# EAGLE board FranKinksTides (EAGLE 7.2.0), part 1 of 2
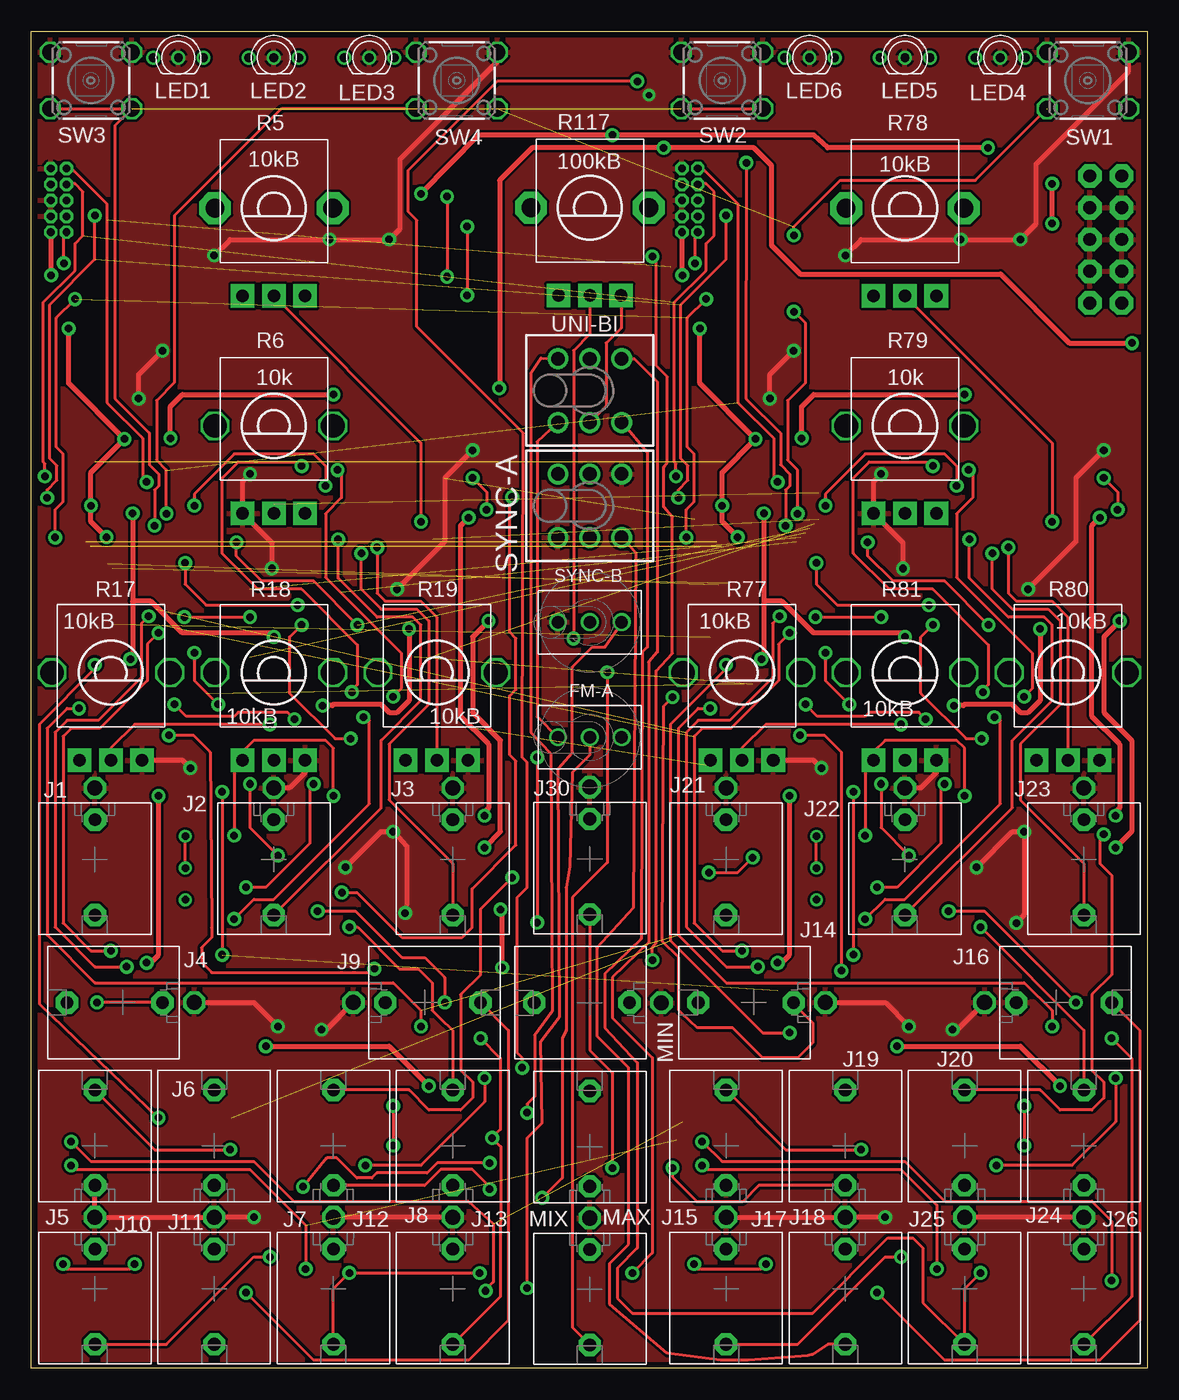
[diagram p7: board, top side]
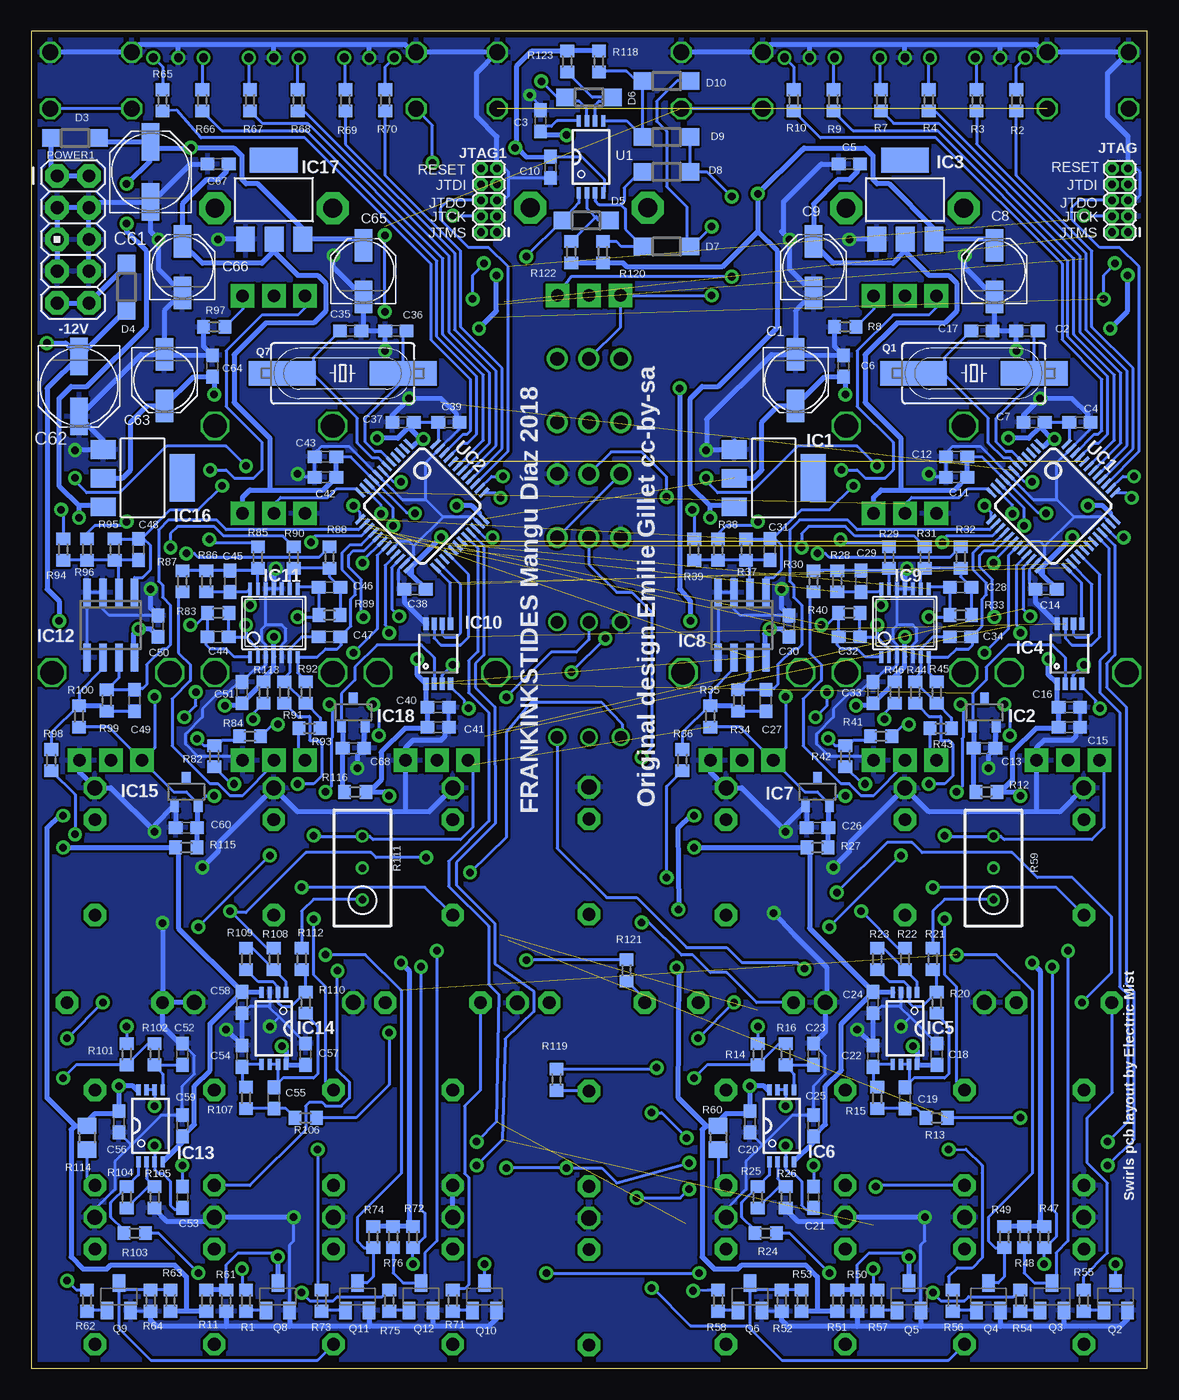
[diagram p8: board, bottom side, seen from below]

Size 89.14 x 106.8 mm. Coordinates in mm from the lower left corner, seen from the top.
Outline: 89.14,0 0,0 0,106.8 89.14,106.8 89.14,0
Copper layers (1*16): Top 0.035mm / dielectric 1.5mm / Bottom 0.035mm
Design rules "PCBCart-Standard *": minimum track width 10mil, minimum drill 0.4mm, track to track 8mil, track to pad 8mil, pad to pad 8mil, via to via 8mil, smd to smd 8mil, copper to edge 20mil, drill to drill 8mil, minimum pad ring 8mil, minimum via ring 10mil, stop-mask expansion 3mil, vias tented up to drill 25mil, thermal gap 8mil

## Footprints (pad centres in the part's own frame; a part is rotated, then mirrored left to right if it is on the bottom)
PANASONIC_C = smd 2.6 x 1.4: + 2.05,0; - -2.05,0
C0603 = smd 1.1 x 1: 1 -0.85,0; 2 0.85,0
PANASONIC_D = smd 3 x 1.4: + 2.4,0; - -2.4,0
SOD123 = smd 1.4 x 1.4: A 1.9,0; C -1.9,0
SUBMINI_TOGGLE = drill 1 pad 1.422: 1 -2.54,0; 3 2.54,0; COM 0,0
SOT223 = smd 1.499 x 2.007: 1 -2.261,-3.15; 2 0.025,-3.15; 3 2.311,-3.15 | smd 3.81 x 2.007: 4 0,3.15
DBZ_R-PDSO-G3 = smd 0.7 x 1: 1 -0.95,-1.1; 2 0.95,-1.1; 3 0,1.1
MSOP-8 = smd 0.41 x 1.02: 1 -0.975,-2.4; 2 -0.325,-2.4; 3 0.325,-2.4; 4 0.975,-2.4; 5 0.975,2.4; 6 0.325,2.4; 7 -0.325,2.4; 8 -0.975,2.4
TSSOP-8 = smd 0.9 x 0.35: 1 -2.875,0.975; 2 -2.875,0.325; 3 -2.875,-0.325; 4 -2.875,-0.975; 5 2.875,-0.975; 6 2.875,-0.325; 7 2.875,0.325; 8 2.875,0.975
SO08 = smd 0.6 x 2.2: 1 -1.905,-2.6; 2 -0.635,-2.6; 3 0.635,-2.6; 4 1.905,-2.6; 5 1.905,2.6; 6 0.635,2.6; 7 -0.635,2.6; 8 -1.905,2.6
TSSOP14 = smd 0.305 x 0.991: 1 -1.905,-2.718; 2 -1.27,-2.718; 3 -0.635,-2.718; 4 0,-2.718; 5 0.635,-2.718; 6 1.27,-2.718; 7 1.905,-2.718; 8 1.905,2.718; 9 1.27,2.718; 10 0.635,2.718; 11 0,2.718; 12 -0.635,2.718; 13 -1.27,2.718; 14 -1.905,2.718
OG-PJ301_VARIATIONS_WQP_PJ_301M6 = drill 1.2 pad 1.778 octagon: P1 0,-5.715 | drill 1.016 pad 1.778 octagon: P2 0,-3.175; P3 0,4.445
2X5-1.27 = drill 0.61 pad 1.067 octagon: 1 -1.27,3.81; 2 0,3.81; 3 -1.27,2.54; 4 0,2.54; 5 -1.27,1.27; 6 0,1.27; 7 -1.27,0; 8 0,0; 9 -1.27,-1.27; 10 0,-1.27
LED-BICOLOR-THROUGHHOLE = drill 0.7: 1 -2,0; 2 0,0; 3 2,0
AVR_ICSP = drill 1.016 pad 1.88 octagon: 1 -1.27,5.08; 2 1.27,5.08; 3 -1.27,2.54; 4 1.27,2.54; 5 -1.27,0; 6 1.27,0; 7 -1.27,-2.54; 8 1.27,-2.54; 9 -1.27,-5.08; 10 1.27,-5.08
HC49UP = smd 5.334 x 1.93: 1 -4.826,0; 2 4.826,0
SOT23-BEC = smd 1 x 1.4: B -0.95,-1.1; C 0,1.1; E 0.95,-1.1
R0603 = smd 1 x 1.1: 1 -0.85,0; 2 0.85,0
ALPS_POT_VERTICAL_PS = drill 1 pad 1.88 square: P$1 -2.5,7; P$2 0,7; P$3 2.5,7 | drill 1.5 pad 2.54 octagon: P$4 -4.7,0; P$5 4.7,0
TALLTRIMMER = drill 1 pad 1.88 square: P$1 -2.5,7; P$2 0,7; P$3 2.5,7 | drill 1.9 pad 2.1 octagon: P$4 -4.7,0; P$5 4.7,0
RTRIM3296W = drill 0.61: 1 0,-2.54; 2 0,0; 3 0,2.54
R0805 = smd 1.3 x 1.5: 1 -0.95,0; 2 0.95,0
TL1100X = drill 1.27 octagon: 1 -3.251,-2.261; 2 3.251,-2.261; 3 -3.251,2.261; 4 3.251,2.261
TL4XPO = drill 1.1 pad 1.676: 1 -2.54,2.54; 2 0,2.54; 3 2.54,2.54; 4 -2.54,-2.54; 5 0,-2.54; 6 2.54,-2.54
LQFP48 = smd 0.254 x 1: 1 -2.75,-4.25; 2 -2.25,-4.25; 3 -1.75,-4.25; 4 -1.25,-4.25; 5 -0.75,-4.25; 6 -0.25,-4.25; 7 0.25,-4.25; 8 0.75,-4.25; 9 1.25,-4.25; 10 1.75,-4.25; 11 2.25,-4.25; 12 2.75,-4.25; 25 2.75,4.25; 26 2.25,4.25; 27 1.75,4.25; 28 1.25,4.25; 29 0.75,4.25; 30 0.25,4.25; 31 -0.25,4.25; 32 -0.75,4.25; 33 -1.25,4.25; 34 -1.75,4.25; 35 -2.25,4.25; 36 -2.75,4.25 | smd 1 x 0.254: 13 4.25,-2.75; 14 4.25,-2.25; 15 4.25,-1.75; 16 4.25,-1.25; 17 4.25,-0.75; 18 4.25,-0.25; 19 4.25,0.25; 20 4.25,0.75; 21 4.25,1.25; 22 4.25,1.75; 23 4.25,2.25; 24 4.25,2.75; 37 -4.25,2.75; 38 -4.25,2.25; 39 -4.25,1.75; 40 -4.25,1.25; 41 -4.25,0.75; 42 -4.25,0.25; 43 -4.25,-0.25; 44 -4.25,-0.75; 45 -4.25,-1.25; 46 -4.25,-1.75; 47 -4.25,-2.25; 48 -4.25,-2.75

## Placement (x,y rotation side)
C1  22u  [PANASONIC_C]  28.1,78.93 270 bottom
C2  18p  [C0603]  9.62,82.85 0 bottom
C3  100n  [C0603]  48.47,99.64 90 bottom
C4  100n  [C0603]  5.4,75.56 0 bottom
C5  100n  [C0603]  23.81,96.2 180 bottom
C6  100n  [C0603]  24.28,80.06 90 bottom
C7  100n  [C0603]  9.05,75.56 180 bottom
C8  22u  [PANASONIC_C]  12.22,87.63 90 bottom
C9  22u  [PANASONIC_C]  26.67,87.95 90 bottom
C10  100n  [C0603]  47.67,95.93 90 bottom
C11  3.3u  [C0603]  15.24,71.18 180 bottom
C12  100n  [C0603]  15.24,72.82 180 bottom
C13  470n  [C0603]  13.02,49.53 0 bottom
C14  100n  [C0603]  8.1,62.23 180 bottom
C15  3.3u  [C0603]  6.24,51.2 0 bottom
C16  100n  [C0603]  6.24,52.78 0 bottom
C17  18p  [C0603]  13.23,82.87 180 bottom
C18  100n  [C0603]  16.83,25.08 90 bottom
C19  220p  [C0603]  19.37,21.59 90 bottom
C20  100n  [C0603]  31.75,19.68 270 bottom
C21  220p  [C0603]  26.67,13.65 270 bottom
C22  220p  [C0603]  21.91,24.93 90 bottom
C23  220p  [C0603]  26.67,25.08 90 bottom
C24  100n  [C0603]  21.91,29.21 90 bottom
C25  100n  [C0603]  26.67,19.37 270 bottom
C26  470n  [C0603]  26.35,43.18 180 bottom
C27  1n  [C0603]  30.48,53.34 90 bottom
C28  10n  [C0603]  14.92,62.39 180 bottom
C29  10n  [C0603]  22.86,62.87 270 bottom
C30  100n  [C0603]  28.62,59.28 90 bottom
C31  1n  [C0603]  30.16,65.41 90 bottom
C32  10n  [C0603]  23.81,58.42 180 bottom
C33  100n  [C0603]  21.91,53.98 90 bottom
C34  1n  [C0603]  14.92,58.42 0 bottom
C35  18p  [C0603]  63.63,82.87 180 bottom
C36  18p  [C0603]  60.02,82.85 0 bottom
C37  100n  [C0603]  59.45,75.56 180 bottom
C38  100n  [C0603]  58.5,62.23 180 bottom
C39  100n  [C0603]  55.8,75.56 0 bottom
C40  100n  [C0603]  56.64,52.78 0 bottom
C41  3.3u  [C0603]  56.64,51.2 0 bottom
C42  3.3u  [C0603]  65.64,71.18 180 bottom
C43  100n  [C0603]  65.64,72.82 180 bottom
C44  10n  [C0603]  74.21,58.42 180 bottom
C45  10n  [C0603]  73.26,62.87 270 bottom
C46  10n  [C0603]  65.32,62.39 180 bottom
C47  1n  [C0603]  65.32,58.42 0 bottom
C48  1n  [C0603]  80.56,65.41 90 bottom
C49  1n  [C0603]  80.88,53.34 90 bottom
C50  100n  [C0603]  79.02,59.28 90 bottom
C51  100n  [C0603]  72.31,53.98 90 bottom
C52  220p  [C0603]  77.07,25.08 90 bottom
C53  220p  [C0603]  77.07,13.65 270 bottom
C54  220p  [C0603]  72.31,24.93 90 bottom
C55  220p  [C0603]  69.77,21.59 90 bottom
C56  100n  [C0603]  82.15,19.68 270 bottom
C57  100n  [C0603]  67.23,25.08 90 bottom
C58  100n  [C0603]  72.31,29.21 90 bottom
C59  100n  [C0603]  77.07,19.37 270 bottom
C60  470n  [C0603]  76.75,43.18 180 bottom
C61  47u  [PANASONIC_D]  79.61,95.57 90 bottom
C62  47u  [PANASONIC_D]  85.33,78.42 270 bottom
C63  22u  [PANASONIC_C]  78.5,78.93 270 bottom
C64  100n  [C0603]  74.68,80.06 90 bottom
C65  22u  [PANASONIC_C]  62.62,87.63 90 bottom
C66  22u  [PANASONIC_C]  77.07,87.95 90 bottom
C67  100n  [C0603]  74.21,96.2 180 bottom
C68  470n  [C0603]  63.42,49.53 0 bottom
D3  1N5819HW  [SOD123]  85.64,98.27 180 bottom
D4  1N5819HW  [SOD123]  81.52,86.36 270 bottom
D5  1N4148  [SOD123]  44.83,91.69 0 bottom
D6  1N4148  [SOD123]  44.6,101.53 180 bottom
D7  1N4148  [SOD123]  38.41,89.61 180 bottom
D8  1N4148  [SOD123]  38.41,95.58 180 bottom
D9  1N4148  [SOD123]  38.41,98.36 0 bottom
D10  1N4148  [SOD123]  38.41,102.83 0 bottom
FM-A  SUBMINI_SPDT  [SUBMINI_TOGGLE]  44.6,50.4 0 top
IC1  LM1117-3.3  [SOT223]  29.84,71.12 270 bottom
IC2  LM4040B25  [DBZ_R-PDSO-G3]  13.02,52.39 0 bottom
IC3  LM1117-3.3  [SOT223]  19.37,93.34 0 bottom
IC4  DAC8552  [MSOP-8]  6.24,57.07 0 bottom
IC5  TL072  [TSSOP-8]  19.37,27.14 270 bottom
IC6  TL072  [TSSOP-8]  29.21,19.37 90 bottom
IC7  LM4040B10  [DBZ_R-PDSO-G3]  26.35,46.04 0 bottom
IC8  MCP6002  [SO08]  32.38,59.37 180 bottom
IC9  MCP6004  [TSSOP14]  19.37,59.53 0 bottom
IC10  DAC8552  [MSOP-8]  56.64,57.07 0 bottom
IC11  MCP6004  [TSSOP14]  69.77,59.53 0 bottom
IC12  MCP6002  [SO08]  82.78,59.37 180 bottom
IC13  TL072  [TSSOP-8]  79.61,19.37 90 bottom
IC14  TL072  [TSSOP-8]  69.77,27.14 270 bottom
IC15  LM4040B10  [DBZ_R-PDSO-G3]  76.75,46.04 0 bottom
IC16  LM1117-3.3  [SOT223]  80.25,71.12 270 bottom
IC17  LM1117-3.3  [SOT223]  69.77,93.34 0 bottom
IC18  LM4040B25  [DBZ_R-PDSO-G3]  63.42,52.39 0 bottom
J1  PJ301_GUI6  [OG-PJ301_VARIATIONS_WQP_PJ_301M6]  5.08,40.64 180 top
J2  PJ301_GUI6  [OG-PJ301_VARIATIONS_WQP_PJ_301M6]  19.37,40.64 180 top
J3  PJ301_GUI6  [OG-PJ301_VARIATIONS_WQP_PJ_301M6]  33.66,40.64 180 top
J4  PJ301_GUI6  [OG-PJ301_VARIATIONS_WQP_PJ_301M6]  7.3,29.21 90 top
J5  PJ301_GUI6  [OG-PJ301_VARIATIONS_WQP_PJ_301M6]  5.08,17.78 0 top
J6  PJ301_GUI6  [OG-PJ301_VARIATIONS_WQP_PJ_301M6]  14.61,17.78 0 top
J7  PJ301_GUI6  [OG-PJ301_VARIATIONS_WQP_PJ_301M6]  24.13,17.78 0 top
J8  PJ301_GUI6  [OG-PJ301_VARIATIONS_WQP_PJ_301M6]  33.66,17.78 0 top
J9  PJ301_GUI6  [OG-PJ301_VARIATIONS_WQP_PJ_301M6]  31.44,29.21 270 top
J10  PJ301_GUI6  [OG-PJ301_VARIATIONS_WQP_PJ_301M6]  5.08,6.35 180 top
J11  PJ301_GUI6  [OG-PJ301_VARIATIONS_WQP_PJ_301M6]  14.61,6.35 180 top
J12  PJ301_GUI6  [OG-PJ301_VARIATIONS_WQP_PJ_301M6]  24.13,6.35 180 top
J13  PJ301_GUI6  [OG-PJ301_VARIATIONS_WQP_PJ_301M6]  33.66,6.35 180 top
J14  PJ301_GUI6  [OG-PJ301_VARIATIONS_WQP_PJ_301M6]  57.7,29.21 90 top
J15  PJ301_GUI6  [OG-PJ301_VARIATIONS_WQP_PJ_301M6]  55.48,17.78 0 top
J16  PJ301_GUI6  [OG-PJ301_VARIATIONS_WQP_PJ_301M6]  81.84,29.21 270 top
J17  PJ301_GUI6  [OG-PJ301_VARIATIONS_WQP_PJ_301M6]  55.48,6.35 180 top
J18  PJ301_GUI6  [OG-PJ301_VARIATIONS_WQP_PJ_301M6]  65,6.35 180 top
J19  PJ301_GUI6  [OG-PJ301_VARIATIONS_WQP_PJ_301M6]  65,17.78 0 top
J20  PJ301_GUI6  [OG-PJ301_VARIATIONS_WQP_PJ_301M6]  74.53,17.78 0 top
J21  PJ301_GUI6  [OG-PJ301_VARIATIONS_WQP_PJ_301M6]  55.48,40.64 180 top
J22  PJ301_GUI6  [OG-PJ301_VARIATIONS_WQP_PJ_301M6]  69.77,40.64 180 top
J23  PJ301_GUI6  [OG-PJ301_VARIATIONS_WQP_PJ_301M6]  84.06,40.64 180 top
J24  PJ301_GUI6  [OG-PJ301_VARIATIONS_WQP_PJ_301M6]  84.06,17.78 0 top
J25  PJ301_GUI6  [OG-PJ301_VARIATIONS_WQP_PJ_301M6]  74.53,6.35 180 top
J26  PJ301_GUI6  [OG-PJ301_VARIATIONS_WQP_PJ_301M6]  84.06,6.35 180 top
J30  PJ301_GUI6  [OG-PJ301_VARIATIONS_WQP_PJ_301M6]  44.6,40.7 180 top
JTAG  M05X2MINIJTAG  [2X5-1.27]  2.82,94.56 180 bottom
JTAG1  M05X2MINIJTAG  [2X5-1.27]  53.22,94.56 180 bottom
LED1  WP115VEGW  [LED-BICOLOR-THROUGHHOLE]  11.75,104.68 0 top
LED2  WP115VEGW  [LED-BICOLOR-THROUGHHOLE]  19.37,104.68 0 top
LED3  WP115VEGW  [LED-BICOLOR-THROUGHHOLE]  26.99,104.68 0 top
LED4  WP115VEGW  [LED-BICOLOR-THROUGHHOLE]  77.39,104.68 0 top
LED5  WP115VEGW  [LED-BICOLOR-THROUGHHOLE]  69.77,104.68 0 top
LED6  WP115VEGW  [LED-BICOLOR-THROUGHHOLE]  62.15,104.68 0 top
MAX  PJ301_GUI6  [OG-PJ301_VARIATIONS_WQP_PJ_301M6]  44.6,17.7 0 top
MIN  PJ301_GUI6  [OG-PJ301_VARIATIONS_WQP_PJ_301M6]  44.6,29.2 90 top
MIX  PJ301_GUI6  [OG-PJ301_VARIATIONS_WQP_PJ_301M6]  44.6,6.3 180 top
POWER1  M05X2PTH  [AVR_ICSP]  85.8,90.17 0 bottom
Q1  8MHz  [HC49UP]  13.87,79.48 0 bottom
Q2  MMBT3904  [SOT23-BEC]  2.54,5.71 0 bottom
Q3  MMBT3904  [SOT23-BEC]  7.62,5.71 0 bottom
Q4  MMBT3904  [SOT23-BEC]  12.7,5.71 0 bottom
Q5  MMBT3904  [SOT23-BEC]  19.05,5.71 0 bottom
Q6  MMBT3904  [SOT23-BEC]  31.75,5.71 0 bottom
Q7  8MHz  [HC49UP]  64.27,79.48 0 bottom
Q8  MMBT3904  [SOT23-BEC]  69.45,5.71 0 bottom
Q9  MMBT3904  [SOT23-BEC]  82.15,5.71 0 bottom
Q10  MMBT3904  [SOT23-BEC]  52.94,5.71 0 bottom
Q11  MMBT3904  [SOT23-BEC]  63.1,5.71 0 bottom
Q12  MMBT3904  [SOT23-BEC]  58.02,5.71 0 bottom
R1  10k  [R0603]  71.99,5.4 270 bottom
R2  100  [R0603]  10.48,101.28 90 bottom
R3  100  [R0603]  13.65,101.28 90 bottom
R4  100  [R0603]  17.46,101.28 90 bottom
R5  10kB  [ALPS_POT_VERTICAL_PS]  19.37,92.66 180 top
R6  10k  [TALLTRIMMER]  19.37,75.28 180 top
R7  100  [R0603]  21.27,101.28 90 bottom
R8  2.49k  [R0603]  24.13,83.19 0 bottom
R9  100  [R0603]  25.08,101.28 90 bottom
R10  100  [R0603]  28.26,101.28 90 bottom
R11  4.7k  [R0603]  75.17,5.4 270 bottom
R12  3.3k  [R0603]  12.86,46.04 180 bottom
R13  33k  [R0603]  16.83,20 0 bottom
R14  100k  [R0603]  31.11,25.08 90 bottom
R15  33k  [R0603]  21.59,21.59 270 bottom
R16  100k  [R0603]  28.89,25.08 90 bottom
R17  10kB  [TALLTRIMMER]  6.35,55.56 180 top
R18  10kB  [TALLTRIMMER]  19.37,55.56 180 top
R19  10kB  [TALLTRIMMER]  32.38,55.56 180 top
R20  30k  [R0603]  16.83,29.21 270 bottom
R21  220k  [R0603]  17.14,32.7 90 bottom
R22  100  [R0603]  19.37,32.7 270 bottom
R23  120k  [R0603]  21.59,32.7 270 bottom
R24  100  [R0603]  30.48,10.79 180 bottom
R25  220k  [R0603]  31.11,13.65 270 bottom
R26  100k  [R0603]  28.89,13.65 90 bottom
R27  270  [R0603]  26.35,41.59 0 bottom
R28  33k  [R0603]  24.77,62.87 90 bottom
R29  100k  [R0603]  20.64,64.77 90 bottom
R30  100k  [R0603]  26.67,62.87 270 bottom
R31  100k  [R0603]  17.78,64.77 90 bottom
R32  100k  [R0603]  14.92,64.77 90 bottom
R33  33k  [R0603]  14.92,60.16 0 bottom
R34  20k  [R0603]  32.7,53.34 270 bottom
R35  120k  [R0603]  34.92,52.07 270 bottom
R36  100k  [R0603]  37.15,48.58 270 bottom
R37  27k  [R0603]  32.07,65.41 270 bottom
R38  100k  [R0603]  34.29,65.41 90 bottom
R39  100k  [R0603]  36.2,65.41 90 bottom
R40  33k  [R0603]  23.81,60.33 0 bottom
R41  100k  [R0603]  21.27,50.48 0 bottom
R42  100k  [R0603]  24.13,48.9 270 bottom
R43  120k  [R0603]  16.51,51.12 180 bottom
R44  100k  [R0603]  18.54,53.98 270 bottom
R45  39k  [R0603]  16.83,53.98 270 bottom
R46  3.3M  [R0603]  20.19,53.98 90 bottom
R47  10k  [R0603]  8.26,10.48 90 bottom
R48  10k  [R0603]  9.84,10.48 90 bottom
R49  10k  [R0603]  11.43,10.48 90 bottom
R50  3.3k  [R0603]  23.18,5.4 90 bottom
R51  4.7k  [R0603]  24.77,5.4 270 bottom
R52  3.3k  [R0603]  29.21,5.4 90 bottom
R53  4.7k  [R0603]  27.62,5.4 270 bottom
R54  100k  [R0603]  10.16,5.4 270 bottom
R55  100k  [R0603]  5.08,5.4 270 bottom
R56  100k  [R0603]  15.56,5.4 270 bottom
R57  10k  [R0603]  21.59,5.4 270 bottom
R58  10k  [R0603]  34.29,5.4 270 bottom
R59  50k  [RTRIM3296W]  12.3,39.96 0 bottom
R60  2.49k  [R0805]  34.29,18.41 270 bottom
R61  3.3k  [R0603]  73.58,5.4 90 bottom
R62  10k  [R0603]  84.69,5.4 270 bottom
R63  4.7k  [R0603]  78.02,5.4 270 bottom
R64  3.3k  [R0603]  79.61,5.4 90 bottom
R65  100  [R0603]  78.66,101.28 90 bottom
R66  100  [R0603]  75.48,101.28 90 bottom
R67  100  [R0603]  71.67,101.28 90 bottom
R68  100  [R0603]  67.86,101.28 90 bottom
R69  100  [R0603]  64.05,101.28 90 bottom
R70  100  [R0603]  60.88,101.28 90 bottom
R71  100k  [R0603]  55.48,5.4 270 bottom
R72  10k  [R0603]  58.66,10.48 90 bottom
R73  100k  [R0603]  65.96,5.4 270 bottom
R74  10k  [R0603]  61.83,10.48 90 bottom
R75  100k  [R0603]  60.56,5.4 270 bottom
R76  10k  [R0603]  60.24,10.48 90 bottom
R77  10kB  [TALLTRIMMER]  56.75,55.56 180 top
R78  10kB  [ALPS_POT_VERTICAL_PS]  69.77,92.66 180 top
R79  10k  [TALLTRIMMER]  69.77,75.28 180 top
R80  10kB  [TALLTRIMMER]  82.78,55.56 180 top
R81  10kB  [TALLTRIMMER]  69.77,55.56 180 top
R82  100k  [R0603]  74.53,48.9 270 bottom
R83  33k  [R0603]  74.21,60.33 0 bottom
R84  100k  [R0603]  71.67,50.48 0 bottom
R85  100k  [R0603]  71.04,64.77 90 bottom
R86  33k  [R0603]  75.17,62.87 90 bottom
R87  100k  [R0603]  77.07,62.87 270 bottom
R88  100k  [R0603]  65.32,64.77 90 bottom
R89  33k  [R0603]  65.32,60.16 0 bottom
R90  100k  [R0603]  68.18,64.77 90 bottom
R91  100k  [R0603]  68.94,53.98 270 bottom
R92  39k  [R0603]  67.23,53.98 270 bottom
R93  120k  [R0603]  66.91,51.12 180 bottom
R94  100k  [R0603]  86.59,65.41 90 bottom
R95  27k  [R0603]  82.47,65.41 270 bottom
R96  100k  [R0603]  84.69,65.41 90 bottom
R97  2.49k  [R0603]  74.53,83.19 0 bottom
R98  100k  [R0603]  87.55,48.58 270 bottom
R99  20k  [R0603]  83.1,53.34 270 bottom
R100  120k  [R0603]  85.33,52.07 270 bottom
R101  100k  [R0603]  81.52,25.08 90 bottom
R102  100k  [R0603]  79.29,25.08 90 bottom
R103  100  [R0603]  80.88,10.79 180 bottom
R104  220k  [R0603]  81.52,13.65 270 bottom
R105  100k  [R0603]  79.29,13.65 90 bottom
R106  33k  [R0603]  67.23,20 0 bottom
R107  33k  [R0603]  71.99,21.59 270 bottom
R108  100  [R0603]  69.77,32.7 270 bottom
R109  120k  [R0603]  71.99,32.7 270 bottom
R110  30k  [R0603]  67.23,29.21 270 bottom
R111  50k  [RTRIM3296W]  62.7,39.96 0 bottom
R112  220k  [R0603]  67.55,32.7 90 bottom
R113  3.3M  [R0603]  70.59,53.98 90 bottom
R114  2.49k  [R0805]  84.69,18.41 270 bottom
R115  270  [R0603]  76.75,41.59 0 bottom
R116  3.3k  [R0603]  63.26,46.04 180 bottom
R117  100kB  [ALPS_POT_VERTICAL_PS]  44.6,92.7 180 top
R118  220k  [R0603]  43.8,104.39 90 bottom
R119  180  [R0603]  47.2,23.05 90 bottom
R120  220k  [R0603]  43.49,89.15 270 bottom
R121  180  [R0603]  41.6,31.79 90 bottom
R122  220k  [R0603]  46.03,89.15 270 bottom
R123  220k  [R0603]  46.34,104.39 90 bottom
SW1  TL1100X  [TL1100X]  84.37,102.87 180 top
SW2  TL1100X  [TL1100X]  55.16,102.87 180 top
SW3  TL1100X  [TL1100X]  4.76,102.87 180 top
SW4  TL1100X  [TL1100X]  33.97,102.87 180 top
SYNC-A  TL49PO  [TL4XPO]  44.6,68.9 0 top
SYNC-B  SUBMINI_SPDT  [SUBMINI_TOGGLE]  44.6,59.6 0 top
U1  TL072TSSOP  [TSSOP-8]  44.44,96.77 90 bottom
UC1  STM32F103CBT6  [LQFP48]  7.52,68.88 225 bottom
UC2  STM32F103CBT6  [LQFP48]  57.92,68.88 225 bottom
UNI-BI  TL49PO  [TL4XPO]  44.6,78.1 0 top